# Altium schematic sheet 1_P1.schdoc.schdoc
size 469 x 335 mm; Symbol: Sheet-Symbol_A4; Device: Sheet-Symbol_A4; Company: 嘉立创EDA; Version: V1.0; Page Size: A4; @Project Name: 校赛主板; @Page Count: 1; @Update Date: 2024-05-01; @Create Date: 2024-03-22; @Schematic Name: Schematic2; @Page No: 1; @Page Name: P1
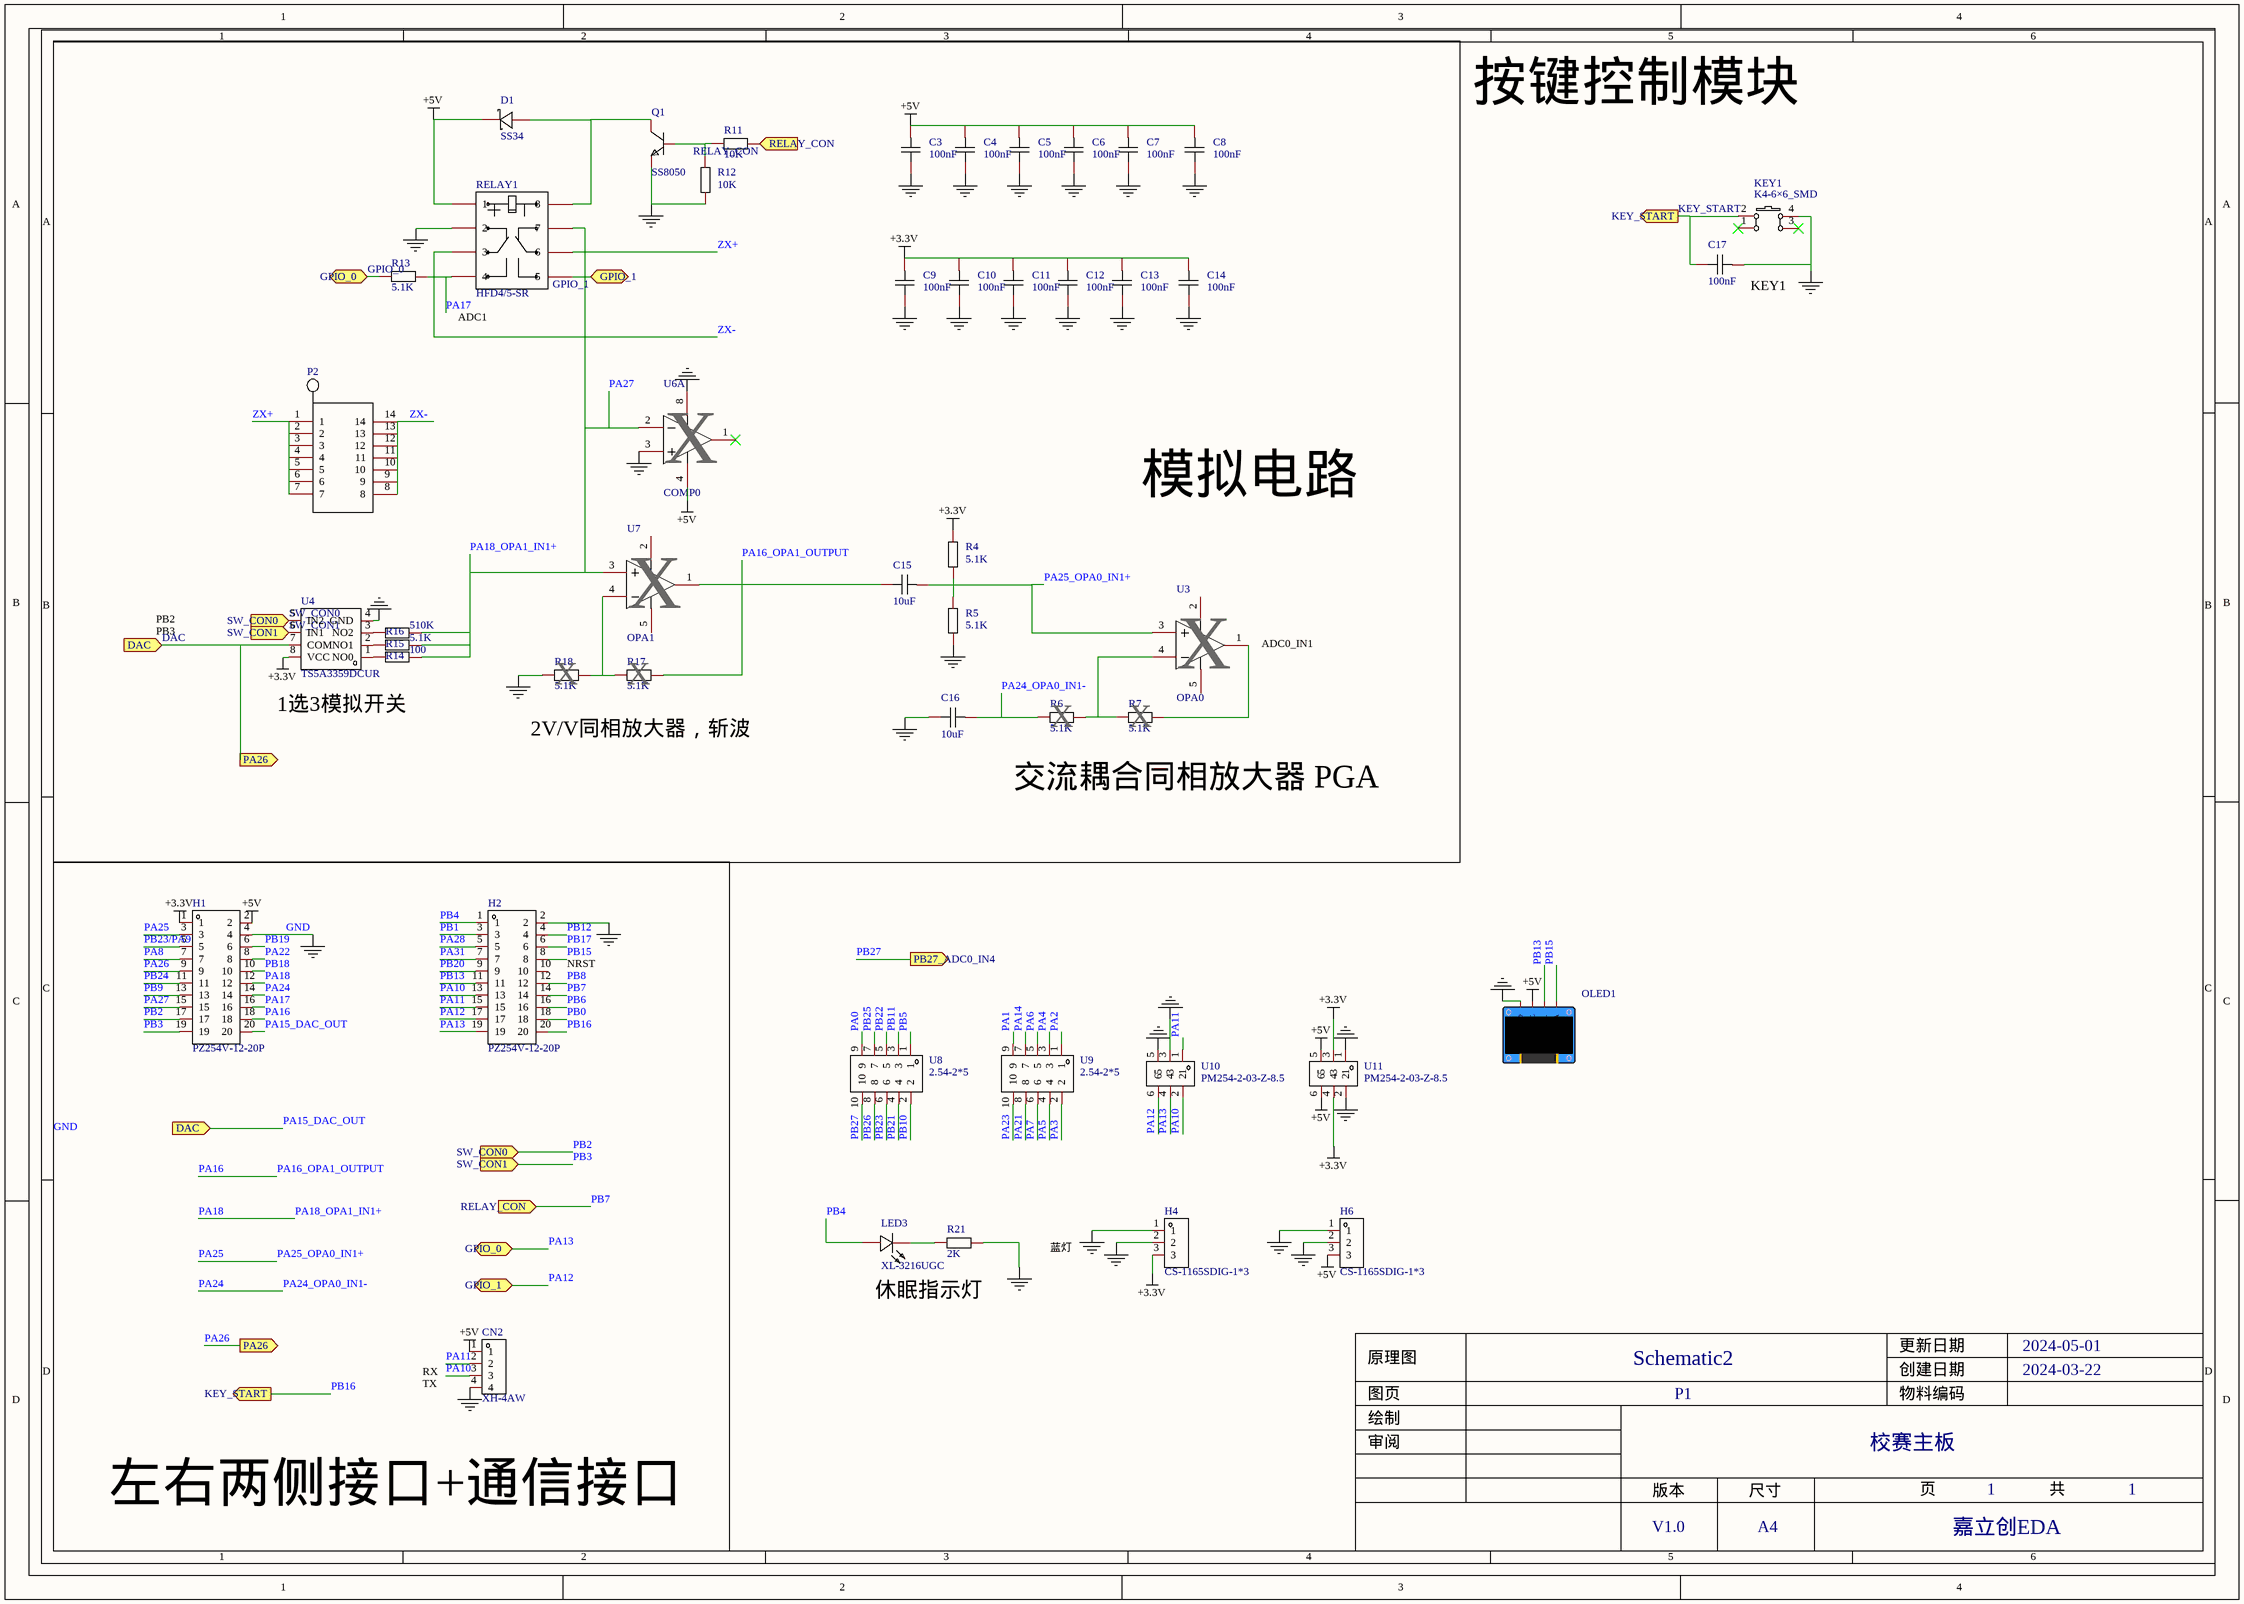
[diagram p0: 1_P1.schdoc.schdoc]

## Parts
C3  100nF  [C0603]
C4  100nF  [C0603]
C5  100nF  [C0603]
C6  100nF  [C0603]
C7  100nF  [C0603]
C8  100nF  [C0603]
C9  100nF  [C0603]
C10  100nF  [C0603]
C11  100nF  [C0603]
C12  100nF  [C0603]
C13  100nF  [C0603]
C14  100nF  [C0603]
C15  10uF  [C0805]
C16  10uF  [C0805]
C17  100nF  [C0603]
CN2  XH-4AW  [CONN-TH_XH-4AW]
D1  SS34  [SMA_L4.3-W2.6-LS5.2-RD]
H1  PZ254V-12-20P  [HDR-TH_20P-P2.54-V-M-R2-C10-S2.54]
H2  PZ254V-12-20P  [HDR-TH_20P-P2.54-V-M-R2-C10-S2.54]
H4  CS-1165SDIG-1*3  [HDR-TH_3P-P2.54_CS-1165SDIG]
H6  CS-1165SDIG-1*3  [HDR-TH_3P-P2.54_CS-1165SDIG]
KEY1  K4-6×6_SMD  [KEY-TH_4P-L6.0-W6.0-P4.50-LS6.5]
LED3  XL-3216UGC  [LED1206-R-RD_GREEN]
OLED1  0.96OLED模块_4P  [0.96OLED_4P]  (value not drawn)
P2  IC锁紧座 14P 2.54mm  [IC锁紧座 14P 2.54mm]  (value not drawn)
Q1  SS8050  [SOT-23-3_L2.9-W1.3-P1.90-LS2.4-BR]
R4  5.1K  [R0603]
R5  5.1K  [R0603]
R6  5.1K  [R0603]
R7  5.1K  [R0603]
R11  10K  [R0603]
R12  10K  [R0603]
R13  5.1K  [R0603]
R14  100  [R0603]
R15  5.1K  [R0603]
R16  510K  [R0603]
R17  5.1K  [R0603]
R18  5.1K  [R0603]
R21  2K  [R0603]
RELAY1  HFD4/5-SR  [RELAY-SMD_HFD4-5-SR]
U3  OPA0  [SOT-23-5_L3.0-W1.7-P0.95-LS2.8-BR]
U4  TS5A3359DCUR  [VSSOP-8_L2.1-W2.4-P0.50-LS3.2-BR]
U6  COMP0  [SOP-8_L4.9-W3.9-P1.27-LS6.0-BL]  (part A of 2)
U7  OPA1  [SOT-23-5_L3.0-W1.7-P0.95-LS2.8-BR]
U8  2.54-2*5  [HDR-TH_10P-P2.54-V-F-R2-C5-S2.54]
U9  2.54-2*5  [HDR-TH_10P-P2.54-V-F-R2-C5-S2.54]
U10  PM254-2-03-Z-8.5  [HDR-TH_6P-P2.54-V-F-R2-C3-S2.54]
U11  PM254-2-03-Z-8.5  [HDR-TH_6P-P2.54-V-F-R2-C3-S2.54]

## Blocks framed on the sheet
左右两侧接口+通信接口: CN2 H1 H2

## Ports
DAC (in), GPIO_0 (bidir), GPIO_1 (bidir), KEY_START (out), PA26 (out), PB27_ADC0_IN4 (out), RELAY_CON (in), SW_CON0 (in), SW_CON1 (in)

## Nets
+3.3V: C9.2 C10.2 C11.2 C12.2 C13.2 C14.2 H1.1 H4.3 R4.1 U4.8(VCC) U11.3 U11.4
+5V: C3.2 C4.2 C5.2 C6.2 C7.2 C8.2 CN2.1 D1.1(K) H1.2 H6.3 OLED1.2(VCC) RELAY1.1 U6.4(GND) U11.5 U11.6
GND: C3.1 C4.1 C5.1 C6.1 C7.1 C8.1 C9.1 C10.1 C11.1 C12.1 C13.1 C14.1 C16.1 C17.2 CN2.4 H1.4 H2.2 H4.1 H4.2 H6.1 H6.2 KEY1.4 OLED1.1(GND) Q1.2(E) R5.2 R12.1 R18.1 R21.2 RELAY1.2 U4.4(GND) U6.3(IN1+) U6.8(VCC) U10.3 U10.5 U11.1 U11.2
DAC: H1.9 H1.20 U4.7(COM) ; port DAC, port PA26  [also labelled PA15_DAC_OUT, PA26]
GPIO_0: H2.19 R13.1 U10.4 ; port GPIO_0  [also labelled PA13]
GPIO_1: H2.17 RELAY1.5 U10.6 ; port GPIO_1  [also labelled PA12]
KEY_START: C17.1 H2.20 KEY1.2 ; port KEY_START  [also labelled PB16]
PA0: U8.9
PA1: U9.9
PA2: U9.1
PA3: U9.2
PA4: U9.3
PA5: U9.4
PA6: U9.5
PA7: U9.6
PA8: H1.7
PA10: CN2.3 H2.13 U10.2
PA11: CN2.2 H2.15 U10.1
PA14: U9.7
PA16: C15.1 H1.18 R17.2 U7.1(OUT)  [also labelled PA16_OPA1_OUTPUT]
PA17: H1.16 R13.2 RELAY1.4
PA18: H1.12 H1.15 R14.2 R15.2 R16.2 RELAY1.7 U6.2(IN1-) U7.3(IN+)  [also labelled PA18_OPA1_IN1+, PA27]
PA21: U9.8
PA22: H1.8
PA23: U9.10
PA24: C16.2 H1.14 R6.1  [also labelled PA24_OPA0_IN1-]
PA25: C15.2 H1.3 R4.2 R5.1 U3.3(IN+)  [also labelled PA25_OPA0_IN1+]
PA28: H2.5
PA31: H2.7
PB0: H2.18
PB1: H2.3
PB2: H1.17 U4.5(IN2) ; port SW_CON0  [also labelled SW_CON0]
PB3: H1.19 U4.6(IN1) ; port SW_CON1  [also labelled SW_CON1]
PB4: H2.1 LED3.1(A)
PB5: U8.1
PB6: H2.16
PB7: H2.14 R11.1 ; port RELAY_CON  [also labelled RELAY_CON]
PB8: H2.12
PB9: H1.13
PB10: U8.2
PB11: U8.3
PB12: H2.4
PB13: H2.11 OLED1.3(SCL)
PB15: H2.8 OLED1.4(SDA)
PB17: H2.6
PB18: H1.10
PB19: H1.6
PB20: H2.9
PB21: U8.4
PB22: U8.5
PB23: U8.6
PB23/PA9: H1.5
PB24: H1.11
PB25: U8.7
PB26: U8.8
PB27: U8.10 ; port PB27_ADC0_IN4
ZX+: P2.1 P2.2 P2.3 P2.4 P2.5 P2.6 P2.7 RELAY1.6
ZX-: P2.8 P2.9 P2.10 P2.11 P2.12 P2.13 P2.14 RELAY1.3
NetD1_2: D1.2(A) Q1.3(C) RELAY1.8
NetLED3_2: LED3.2(K) R21.1
NetQ1_1: Q1.1(B) R11.2 R12.2
NetR6_2: R6.2 R7.1 U3.4(IN-)
NetR7_2: R7.2 U3.1(OUT)
NetR14_1: R14.1 U4.1(NO0)
NetR15_1: R15.1 U4.2(NO1)
NetR16_1: R16.1 U4.3(NO2)
NetR17_1: R17.1 R18.2 U7.4(IN-)

Not connected (* = marked no-connect by the designer): H2 10; KEY1 1* 3*; U3 2(VS-) 5(VS+); U6 1(OUT1)*; U7 2(VS-) 5(VS+)

## Notes on the sheet
- 按键控制模块
- (near C17) KEY1
- ADC1
- (near U6) X
- 模拟电路
- PB2
- PB3
- (near U7) X
- (near U3) ADC0_IN1
- 1选3模拟开关
- (near R18) X
- (near R17) X
- (near U3) X
- 2V/V同相放大器，斩波
- (near R6) X
- (near R7) X
- 交流耦合同相放大器 PGA
- (near H2) NRST
- 蓝灯
- 休眠指示灯
- (near CN2) RX
  TX
- Labels drawn without touching a wire or pin: GND
- 1
- 2
- 3
- 4
- 5
- 6
- A
- B
- C
- D
- 原理图
- Schematic2
- 创建日期
- 更新日期
- 2024-05-01
- 2024-03-22
- 审阅
- 绘制
- 图页
- P1
- 物料编码
- 校赛主板
- 版本
- 尺寸
- 页
- 共
- V1.0
- A4
- 嘉立创EDA

## Library data of the parts
C3-C14 C17 = CAP_0603: Symbol: CapAcitance; Convert to PCB: yes; Name: 100nF; Device: CAP_0603; Add into BOM: yes; Supplier Footprint: 0603; Value: 100nF
C15 C16 = CAP_0805: Symbol: CapAcitance; Convert to PCB: yes; Name: 10uF; Device: CAP_0805; Add into BOM: yes; Supplier Footprint: 0805; Value: 10uF
CN2 = XH-4AW: Manufacturer: HCTL(华灿天禄); Symbol: XH-4AW_C2908613; Add into BOM: yes; Pins Structure: 1x4P; Pitch: 2.54mm; Reference Series: XH; Number of PINs Per Row: 4; Current Rating (Max): 3A; Description: 插针结构:1x4P;间距:2.54mm;安装方式:弯插;参考系列:XH;总PIN数:4P;排数:1;每排PIN数:4;行距:-;额定电流:3A;触头材质:黄铜;触头镀层:锡;工作温度范围:-25℃~+85℃;; Name: XH-4AW; Device: XH-4AW; LCSC Part Name: 1x4P 间距:2.54mm 弯插 系列:XH; Supplier Part: C2908613; Manufacturer Part: XH-4AW; Supplier Footprint: 弯插,P=2.54mm; JLCPCB Part Class: 扩展库; Datasheet: https://atta.szlcsc.com/upload/public/pdf/source/20230711/B565BAF3B11666EF6B81B3605408F2BD.pdf; Supplier: LCSC; Convert to PCB: yes; Mounting Style: 弯插; Number of Pins: 4P; Number of Rows: 1; Row Spacing: -; Contact Material: 黄铜; Contact Plating: 锡; Operating Temperature Range: -25℃~+85℃
D1 = SS34_C8678: Manufacturer: MDD; Add into BOM: yes; Diode Configuration: 独立式; Forward Voltage (Vf@If): 550mV@3A; Reverse Voltage (Vr): 40V; Average Rectified Current (Io): 3A; Reverse Leakage Current (Ir): 500uA@40V; Description: 二极管配置:独立式;正向压降(Vf):550mV@3A;直流反向耐压(Vr):40V;平均整流电流(Io):3A;; Name: SS34; Symbol: SS34_C8678; Device: SS34_C8678; Supplier: LCSC; Manufacturer Part: SS34; Supplier Part: C8678; JLCPCB Part Class: 基础库; LCSC Part Name: 电压:40V 电流:3A; Supplier Footprint: SMA(DO-214AC); Datasheet: https://atta.szlcsc.com/upload/public/pdf/source/20230314/A80AE34493C69B89E2F4B1712F433538.pdf; Convert to PCB: yes
H1 H2 = PZ254V-12-20P: Manufacturer: XFCN(兴飞); Add into BOM: yes; Pin Structure: 2x10P; Pitch: 2.54mm; Circluar Pins/Square Pins: 方针; Description: 插针结构:2x10P;间距:2.54mm;行距:2.54mm;圆针/方针:方针;安装类型:直插;排数:双排;总PIN位数:20P;额定电流:-;额定电压:-;配合针长度:6mm;塑高:2.5mm;端接针长度:3mm;触头材质:黄铜;触头镀层:-;工作温度范围:-40℃~+105℃;颜色:黑色;; Name: PZ254V-12-20P; Symbol: PZ254V-12-20P; Device: PZ254V-12-20P; LCSC Part Name: 间距:2.54mm 2x10P 直插 方针; Supplier Part: C492427; Manufacturer Part: PZ254V-12-20P; Supplier Footprint: 插件,P=2.54mm; JLCPCB Part Class: 扩展库; Datasheet: https://atta.szlcsc.com/upload/public/pdf/source/20200309/C492427_9411E93D35F2EC20CED9A3ED9F4BBE60.pdf; Supplier: LCSC; Convert to PCB: yes; Row Spacing: 2.54mm; Mounting Type: 直插; Number of Rows: 双排; Number of Pins: 20P; Current Rating (Max): -; Voltage Rating (Max): -; Length of Mating Pin: 6mm; Insulation Height: 2.5mm; Length of End Connection Pin: 3mm; Contact Material: 黄铜; Contact Plating: -; Operating Temperature Range: -40℃~+105℃; Color: 黑色
H4 H6 = CS-1165SDIG-1*3: Manufacturer: CST(永丰盈); Add into BOM: yes; Holes Structure: 1x3P; Pitch: 2.54mm; Circular Hole / Square Hole: 方孔; Number of Holes: 3P; Current Rating (Max): 3A; Voltage Rating (Max): 250V; Holes Direction: 顶部; Description: 插孔结构:1x3P;间距:2.54mm;行距:-;圆孔/方孔:方孔;安装类型:直插;排数:单排;总孔位数:3P;额定电流:3A;额定电压:250V;插孔方向:顶部;塑高:8.5mm;工作温度范围:-40℃~+105℃;; Name: CS-1165SDIG-1*3; Symbol: CS-1165SDIG-1*3; Device: CS-1165SDIG-1*3; Supplier: LCSC; Supplier Part: C2886705; Manufacturer Part: CS-1165SDIG-1*3; JLCPCB Part Class: 扩展库; LCSC Part Name: 间距:2.54mm 1x3P 直插; Supplier Footprint: 插件,P=2.54mm; Datasheet: https://atta.szlcsc.com/upload/public/pdf/source/20210907/1318D248467EBBCB1292525B435EEE22.pdf; Convert to PCB: yes; Row Spacing: -; Mounting Type: 直插; Number of Rows: 单排; Insulation Height: 8.5mm; Operating Temperature Range: -40℃~+105℃
KEY1 = K4-6×6_SMD: Manufacturer: 韩国韩荣; Manufacturer Part: K2-6639SP-D4SC-04; Convert to PCB: yes; Origin Footprint: SW-TH_4P-L6.0-W6.0-P4.50-LS6.5; Name: K4-6×6_SMD; Symbol: K4-6×6_SMD; Device: K4-6×6_SMD; Supplier Part: C191626; Supplier: LCSC; Add into BOM: yes
LED3 = XL-3216UGC: Manufacturer: XINGLIGHT(成兴光); Add into BOM: yes; Emitted Color: 翠绿色; Power Dissipation: 80mW; Forward Current: 25mA; Dominant Wavelength: 516nm~525nm; Peak Wavelength: 534nm; Lens Color: 无色透明透镜; Viewing Angle: 120°; Mounting Sytle: 正贴; Description: 发光颜色:翠绿色;功率:80mW;正向电流:25mA;主波长:516nm~525nm;透镜颜色:无色透明透镜;色温:-;发光角度:120°;载带方式:正贴;工作温度:-30℃~+85℃;; Name: XL-3216UGC; Symbol: XL-3216UGC; Device: XL-3216UGC; Supplier: LCSC; Supplier Part: C965825; Manufacturer Part: XL-3216UGC; JLCPCB Part Class: 扩展库; LCSC Part Name: XL-3216UGC; Supplier Footprint: 1206; Datasheet: https://atta.szlcsc.com/upload/public/pdf/source/20221102/F627D30E1E7D99B6115BC150FFFF1508.pdf; Convert to PCB: yes; Color Temperature: -; Operating Temperature: -30℃~+85℃
OLED1 = 0.96OLED模块_4P: Convert to PCB: yes; Symbol: 0.96OLED模块_4P; Device: 0.96OLED模块_4P; Add into BOM: yes; Supplier Footprint: 插件
P2 = IC锁紧座 14P 2.54mm: Add into BOM: yes; Symbol: IC锁紧座 14P 2.54mm; Device: IC锁紧座 14P 2.54mm; Convert to PCB: yes
Q1 = SS8050_C2150: Manufacturer: CJ(江苏长电/长晶); Add into BOM: yes; Transistor Type: NPN; Collector Current (Ic): 1.5A; Collector-Emitter Breakdown Voltage (Vceo): 25V; Power Dissipation (Pd): 300mW; DC Current Gain (hFE@Ic,Vce): 200@100mA,1V; Transition Frequency (fT): 100MHz; Collector Cut-Off Current (Icbo): 100nA; Collector-Emitter Saturation Voltage (VCE(sat)@Ic,Ib): 500mV@800mA,80mA; Description: 晶体管类型:NPN;集电极电流(Ic):1.5A;集射极击穿电压(Vceo):25V;功率(Pd):300mW;直流电流增益(hFE@Ic,Vce):200@100mA,1V;; Name: SS8050; Symbol: SS8050_C2150; Device: SS8050_C2150; LCSC Part Name: SS8050(RANGE:200-350) hfe=200~350; Supplier Part: C2150; Manufacturer Part: SS8050; Supplier Footprint: SOT-23; JLCPCB Part Class: 基础库; Datasheet: https://atta.szlcsc.com/upload/public/pdf/source/20230322/AEE86F4B043774EFF80CAEA14A37D9E9.pdf; Supplier: LCSC; Convert to PCB: yes; Operating Temperature: -
R4-R7 R11-R18 R21 = Res_0603: Symbol: 电阻; Convert to PCB: yes; Device: Res_0603; Add into BOM: yes; Supplier Footprint: 0603
  R4-R7 R13 R15 R17 R18: Name: 5.1K; Value: 5.1K
  R11 R12: Name: 10K; Value: 10K
  R14: Name: 100; Value: 100
  R16: Name: 510K; Value: 510K
  R21: Name: 2K; Value: 2K
RELAY1 = HFD4/5-SR: Manufacturer: HF(宏发); Add into BOM: yes; Coil Voltage: 5V; Contact Form: 两组转换:2C(双刀双掷-转换); Pin Number: 8; Contact Rating: 1A@30VDC；300mA@125VAC; Maximum Switching Voltage: 250V@AC；220V@DC; Coil Rated Power: 140mW; Coil Resistance: 178Ω; Maximum Switching Current: 2A; Operate Time: 3ms; Coil Type: 有极性-单线圈; Contact Resistance: 100mΩ; Description: 线圈电压:5V;触点形式:两组转换:2C(双刀双掷-转换);触点容量(电阻负载):1A@30VDC；300mA@125VAC;最大切换电压:250V@AC；220V@DC;最大切换电流:2A;; Name: HFD4/5-SR; Symbol: HFD4/5-S; Device: HFD4/5-SR; LCSC Part Name: 超小型5V继电器 双刀双掷; Supplier Part: C64399; Manufacturer Part: HFD4/5-SR; Supplier Footprint: SMD,6.5x10mm; JLCPCB Part Class: 扩展库; Datasheet: https://atta.szlcsc.com/upload/public/pdf/source/20170415/1492238463316.pdf; Supplier: LCSC; Convert to PCB: yes; Contact Material: AgNi+镀金; Release Time: 3ms; Operating Temperature: -40℃~+85℃
U3 U7 = OPA365AIDBVR: Manufacturer: TI(德州仪器); Add into BOM: yes; Number of Circuits: 单路; Gain Bandwidth Product(GBP): 50MHz; Current - Input Bias(Ib): 0.2pA; Slew Rate(SR): 25V/us; Output Current: 65mA; Description: 放大器数:单路;增益带宽积(GBP):50MHz;输入偏置电流(Ib):0.2pA;压摆率(SR):25V/us;带宽(-3db):-;轨到轨:-;; Symbol: OPA365AIDBVR; Device: OPA365AIDBVR; LCSC Part Name: OPA365AIDBVR; Supplier Part: C96626; Supplier Footprint: SOT-23-5; JLCPCB Part Class: 扩展库; Datasheet: https://www.ti.com/cn/lit/gpn/opa365; Supplier: LCSC; Convert to PCB: yes; -3db Bandwidth: -; Output Type: -; Rail to Rail: -; Operating Temperature: -40℃~+125℃
  U3: Name: OPA0; Manufacturer Part: OPA0
  U7: Name: OPA1; Manufacturer Part: OPA1
U4 = TS5A3359DCUR: Manufacturer: TI(德州仪器); Add into BOM: yes; Number of Channels: 1; Description: 开关电路:-;通道数:1;; Name: TS5A3359DCUR; Symbol: TS5A3359DCUR; Device: TS5A3359DCUR; Supplier: LCSC; Supplier Part: C478071; Manufacturer Part: TS5A3359DCUR; JLCPCB Part Class: 扩展库; LCSC Part Name: TS5A3359DCUR; Supplier Footprint: VSSOP-8-2.3mm; Datasheet: https://www.ti.com/cn/lit/gpn/ts5a3359; Convert to PCB: yes; Switch Circuit: -
U6 = LM393M/TR: Manufacturer: HGSEMI(华冠); Add into BOM: yes; Name: COMP0; Symbol: LM393M/TR; Device: LM393M/TR; LCSC Part Name: LM393M/TR; Supplier Part: C356703; Manufacturer Part: COMP0; Supplier Footprint: SOP-8; JLCPCB Part Class: 扩展库; Datasheet: https://atta.szlcsc.com/upload/public/pdf/source/20190729/C356703_888613A23C3E9B493914813A126885CA.pdf; Supplier: LCSC; Convert to PCB: yes
U8 U9 = 2.54-2*5: Manufacturer: ZHOURI(洲日); Add into BOM: yes; Holes Structure: 2x5P; Pitch: 2.54mm; Circular Hole / Square Hole: 方孔; Number of Holes: 10P; Current Rating (Max): 2.5A; Holes Direction: 顶部; Description: 插孔结构:2x5P;间距:2.54mm;行距:2.54mm;圆孔/方孔:方孔;安装类型:直插;排数:双排;总孔位数:10P;额定电流:2.5A;额定电压:-;插孔方向:顶部;塑高:8.5mm;工作温度范围:-40℃~+105℃;; Name: 2.54-2*5; Symbol: 2.54-2*5; Device: 2.54-2*5; Supplier: LCSC; Supplier Part: C2977587; Manufacturer Part: 2.54-2*5; JLCPCB Part Class: 扩展库; LCSC Part Name: 间距:2.54mm 2x5P 直插; Supplier Footprint: 插件,P=2.54mm; Datasheet: https://atta.szlcsc.com/upload/public/pdf/source/20220328/53961E697C4FF664B69BABFADEC8B830.pdf; Convert to PCB: yes; Row Spacing: 2.54mm; Mounting Type: 直插; Number of Rows: 双排; Voltage Rating (Max): -; Insulation Height: 8.5mm; Operating Temperature Range: -40℃~+105℃
U10 U11 = PM254-2-03-Z-8.5: Manufacturer: HCTL(华灿天禄); Add into BOM: yes; Holes Structure: 2x3P; Pitch: 2.54mm; Circular Hole / Square Hole: 方孔; Number of Holes: 6P; Current Rating (Max): 3A; Holes Direction: 顶部; Soldering Temperature(Max): 260℃@5S; Description: 插孔结构:2x3P;间距:2.54mm;行距:2.54mm;圆孔/方孔:方孔;安装类型:直插;排数:双排;总孔位数:6P;额定电流:3A;额定电压:-;插孔方向:顶部;塑高:8.5mm;触头材质:铜合金;工作温度范围:-40℃~+105℃;焊接温度(最大值):260℃@5S;; Name: PM254-2-03-Z-8.5; Symbol: PM254-2-03-Z-8.5; Device: PM254-2-03-Z-8.5; LCSC Part Name: 2x3P 间距:2.54mm 直插; Supplier Part: C2897404; Manufacturer Part: PM254-2-03-Z-8.5; Supplier Footprint: 插件,P=2.54mm; JLCPCB Part Class: 扩展库; Datasheet: https://atta.szlcsc.com/upload/public/pdf/source/20230609/3D36CA2C1BFC9FD1C3F709AD9DFEB9C2.pdf; Supplier: LCSC; Convert to PCB: yes; Row Spacing: 2.54mm; Mounting Type: 直插; Number of Rows: 双排; Voltage Rating (Max): -; Insulation Height: 8.5mm; Contact Material: 铜合金; Operating Temperature Range: -40℃~+105℃